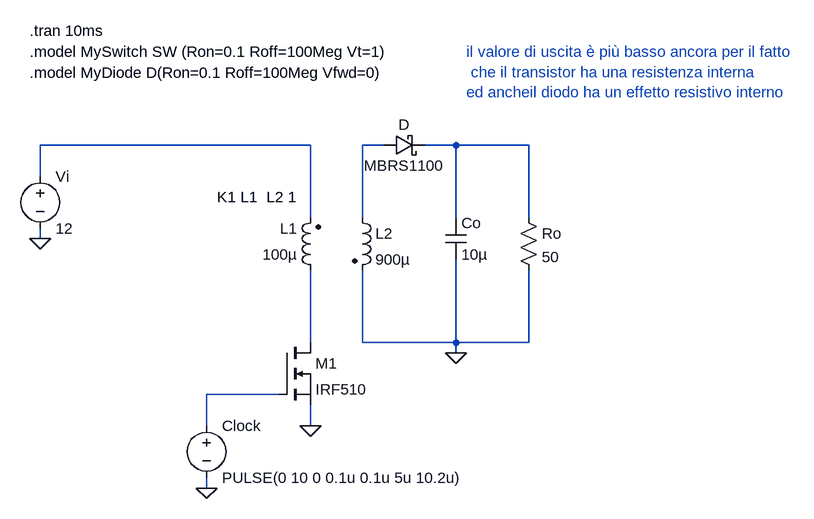
[diagram p0: schematic Flyback Converter  IRF510.asc]
Flyback Converter  IRF510.asc, the LTspice schematic file:
Version 4
SHEET 1 1332 680
WIRE 48 -64 -368 -64
WIRE 160 -64 128 -64
WIRE 272 -64 224 -64
WIRE 384 -64 272 -64
WIRE -368 -16 -368 -64
WIRE 48 48 48 -64
WIRE 128 48 128 -64
WIRE 272 48 272 -64
WIRE 384 48 384 -64
WIRE -368 80 -368 64
WIRE 48 240 48 128
WIRE 128 240 128 128
WIRE 272 240 272 112
WIRE 272 240 128 240
WIRE 384 240 384 128
WIRE 384 240 272 240
WIRE 272 256 272 240
WIRE 0 320 -112 320
WIRE -112 368 -112 320
WIRE 48 368 48 336
WIRE -112 464 -112 448
FLAG -368 80 0
FLAG 48 368 0
FLAG 272 256 0
FLAG -112 464 0
SYMBOL cap 256 48 R0
SYMATTR InstName Co
SYMATTR Value 10µ
SYMBOL res 368 32 R0
SYMATTR InstName Ro
SYMATTR Value 50
SYMBOL voltage -112 352 R0
WINDOW 123 0 0 Left 2
WINDOW 39 0 0 Left 2
SYMATTR InstName Clock
SYMATTR Value PULSE(0 10 0 0.1u 0.1u 5u 10.2u)
SYMBOL voltage -368 -32 R0
WINDOW 123 0 0 Left 2
WINDOW 39 0 0 Left 2
SYMATTR InstName Vi
SYMATTR Value 12
SYMBOL schottky 160 -80 M90
WINDOW 0 0 32 VBottom 2
WINDOW 3 32 32 VTop 2
SYMATTR InstName D
SYMATTR Value MBRS1100
SYMATTR Description Diode
SYMATTR Type diode
SYMBOL ind2 64 144 R180
WINDOW 0 36 80 Left 2
WINDOW 3 36 40 Left 2
SYMATTR InstName L1
SYMATTR Value 100µ
SYMBOL ind2 112 32 R0
SYMATTR InstName L2
SYMATTR Value 900µ
SYMBOL nmos 0 240 R0
SYMATTR InstName M1
SYMATTR Value IRF510
TEXT -384 -240 Left 2 !.tran 10ms
TEXT -384 -208 Left 2 !.model MySwitch SW (Ron=0.1 Roff=100Meg Vt=1)
TEXT -384 -176 Left 2 !.model MyDiode D(Ron=0.1 Roff=100Meg Vfwd=0)
TEXT -96 16 Left 2 !K1 L1  L2 1
TEXT 288 -208 Left 2 ;il valore di uscita è più basso ancora per il fatto\n che il transistor ha una resistenza interna\ned ancheil diodo ha un effetto resistivo interno

The netlist it stands for:
* Flyback Converter  IRF510.asc
Co N003 0 10µ
Ro N003 0 50
V§Clock N005 0 PULSE(0 10 0 0.1u 0.1u 5u 10.2u)
Vi N001 0 12
D N002 N003 MBRS1100
L1 N004 N001 100µ
L2 N002 0 900µ
M1 N004 N005 0 0 IRF510
.model D D
.lib standard.dio
.model NMOS NMOS
.model PMOS PMOS
.lib standard.mos
.tran 10ms
.model MySwitch SW (Ron=0.1 Roff=100Meg Vt=1)
.model MyDiode D(Ron=0.1 Roff=100Meg Vfwd=0)
K1 L1  L2 1
* il valore di uscita è più basso ancora per il fatto
*  che il transistor ha una resistenza interna
* ed ancheil diodo ha un effetto resistivo interno
.backanno
.end